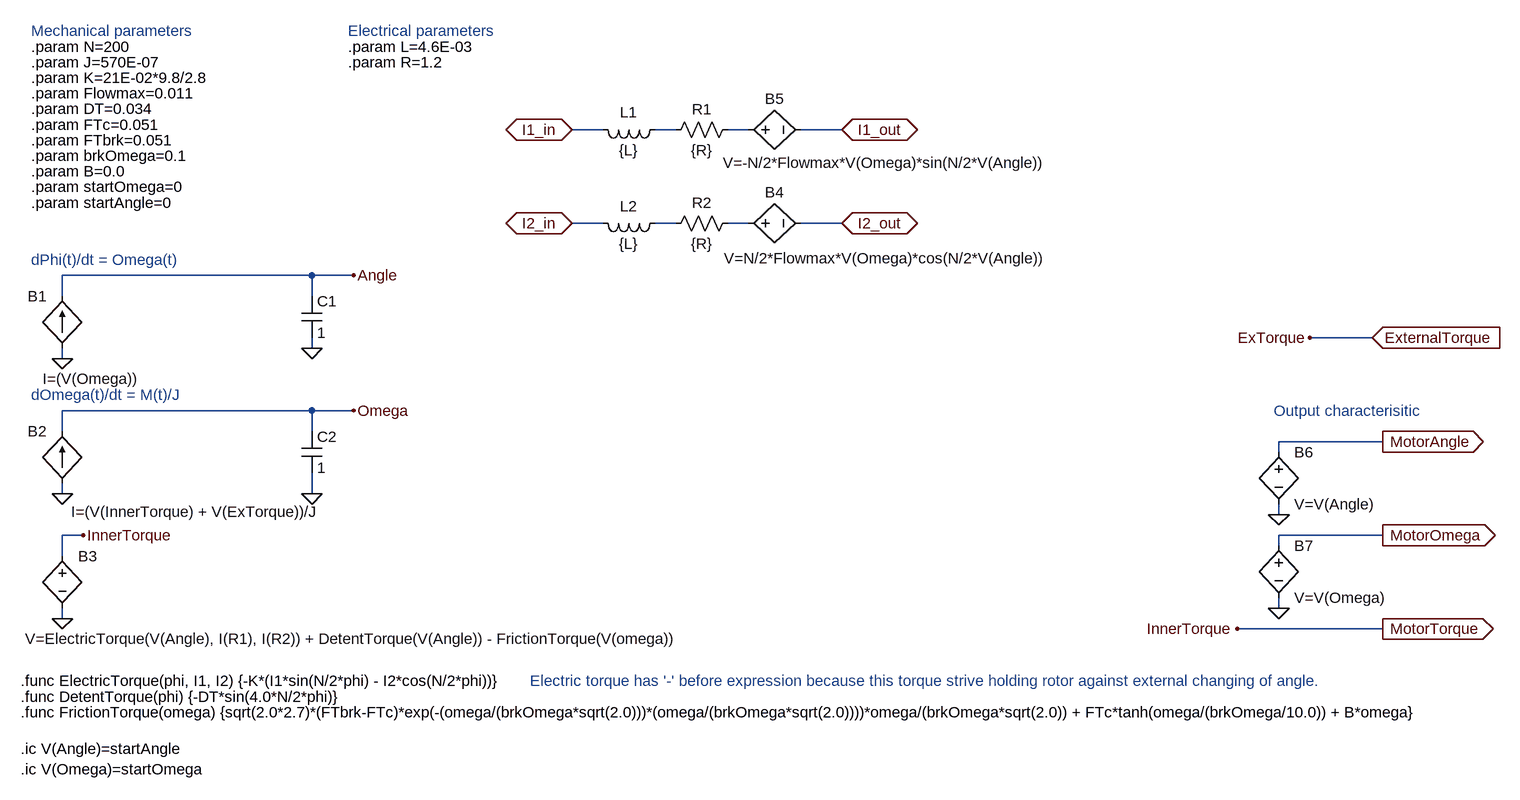
[diagram p0: schematic StepMotor.asc]
StepMotor.asc, the LTspice schematic file:
Version 4
SHEET 1 2772 808
WIRE 1200 -192 1152 -192
WIRE 1312 -192 1280 -192
WIRE 1424 -192 1392 -192
WIRE 1568 -192 1504 -192
WIRE 1200 -48 1152 -48
WIRE 1312 -48 1280 -48
WIRE 1424 -48 1392 -48
WIRE 1568 -48 1504 -48
WIRE 752 32 368 32
WIRE 816 32 752 32
WIRE 368 64 368 32
WIRE 752 64 752 32
WIRE 2384 128 2288 128
WIRE 752 144 752 128
WIRE 368 160 368 144
WIRE 752 240 368 240
WIRE 816 240 752 240
WIRE 368 272 368 240
WIRE 752 272 752 240
WIRE 2400 288 2240 288
WIRE 2240 304 2240 288
WIRE 368 368 368 352
WIRE 752 368 752 336
WIRE 2240 400 2240 384
WIRE 400 432 368 432
WIRE 2400 432 2240 432
WIRE 2240 448 2240 432
WIRE 368 464 368 432
WIRE 2240 544 2240 528
WIRE 368 560 368 544
WIRE 2400 576 2176 576
FLAG 1152 -192 I1_in
IOPIN 1152 -192 BiDir
FLAG 1568 -192 I1_out
IOPIN 1568 -192 BiDir
FLAG 1152 -48 I2_in
IOPIN 1152 -48 BiDir
FLAG 1568 -48 I2_out
IOPIN 1568 -48 BiDir
FLAG 816 32 Angle
FLAG 752 144 0
FLAG 368 160 0
FLAG 752 368 0
FLAG 368 368 0
FLAG 816 240 Omega
FLAG 368 560 0
FLAG 400 432 InnerTorque
FLAG 2240 400 0
FLAG 2240 544 0
FLAG 2400 288 MotorAngle
IOPIN 2400 288 Out
FLAG 2400 432 MotorOmega
IOPIN 2400 432 Out
FLAG 2400 576 MotorTorque
IOPIN 2400 576 Out
FLAG 2384 128 ExternalTorque
IOPIN 2384 128 In
FLAG 2176 576 InnerTorque
FLAG 2288 128 ExTorque
SYMBOL cap 736 64 R0
SYMATTR InstName C1
SYMATTR Value 1
SYMBOL bi 368 144 R180
WINDOW 0 24 80 Left 2
WINDOW 3 -119 -47 Left 2
SYMATTR InstName B1
SYMATTR Value I=(V(Omega))
SYMBOL cap 736 272 R0
SYMATTR InstName C2
SYMATTR Value 1
SYMBOL bi 368 352 R180
WINDOW 0 24 80 Left 2
WINDOW 3 -400 -44 Left 2
SYMATTR InstName B2
SYMATTR Value I=(V(InnerTorque) + V(ExTorque))/J
SYMBOL ind 1296 -208 R90
WINDOW 0 5 56 VBottom 2
WINDOW 3 32 56 VTop 2
SYMATTR InstName L1
SYMATTR Value {L}
SYMBOL res 1296 -176 R270
WINDOW 0 32 56 VTop 2
WINDOW 3 0 56 VBottom 2
SYMATTR InstName R1
SYMATTR Value {R}
SYMBOL ind 1296 -64 R90
WINDOW 0 5 56 VBottom 2
WINDOW 3 32 56 VTop 2
SYMATTR InstName L2
SYMATTR Value {L}
SYMBOL res 1296 -32 R270
WINDOW 0 32 56 VTop 2
WINDOW 3 0 56 VBottom 2
SYMATTR InstName R2
SYMATTR Value {R}
SYMBOL bv 368 448 R0
WINDOW 3 -57 143 Left 2
SYMATTR Value V=ElectricTorque(V(Angle), I(R1), I(R2)) + DetentTorque(V(Angle)) - FrictionTorque(V(omega))
SYMATTR InstName B3
SYMBOL bv 1408 -48 R270
WINDOW 0 32 56 VTop 2
WINDOW 3 -38 227 VBottom 2
SYMATTR InstName B4
SYMATTR Value V=N/2*Flowmax*V(Omega)*cos(N/2*V(Angle))
SYMBOL bv 1408 -192 R270
WINDOW 0 32 56 VTop 2
WINDOW 3 -35 226 VBottom 2
SYMATTR InstName B5
SYMATTR Value V=-N/2*Flowmax*V(Omega)*sin(N/2*V(Angle))
SYMBOL bv 2240 288 R0
SYMATTR InstName B6
SYMATTR Value V=V(Angle)
SYMBOL bv 2240 432 R0
SYMATTR InstName B7
SYMATTR Value V=V(Omega)
TEXT 320 -320 Left 2 !.param N=200
TEXT 320 -296 Left 2 !.param J=570E-07
TEXT 320 -272 Left 2 !.param K=21E-02*9.8/2.8
TEXT 320 -224 Left 2 !.param DT=0.034
TEXT 320 -200 Left 2 !.param FTc=0.051
TEXT 320 -344 Left 2 ;Mechanical parameters
TEXT 808 -344 Left 2 ;Electrical parameters
TEXT 808 -320 Left 2 !.param L=4.6E-03
TEXT 808 -296 Left 2 !.param R=1.2
TEXT 320 8 Left 2 ;dPhi(t)/dt = Omega(t)
TEXT 320 216 Left 2 ;dOmega(t)/dt = M(t)/J
TEXT 304 656 Left 2 !.func ElectricTorque(phi, I1, I2) {-K*(I1*sin(N/2*phi) - I2*cos(N/2*phi))}
TEXT 304 680 Left 2 !.func DetentTorque(phi) {-DT*sin(4.0*N/2*phi)}
TEXT 304 704 Left 2 !.func FrictionTorque(omega) {sqrt(2.0*2.7)*(FTbrk-FTc)*exp(-(omega/(brkOmega*sqrt(2.0)))*(omega/(brkOmega*sqrt(2.0))))*omega/(brkOmega*sqrt(2.0)) + FTc*tanh(omega/(brkOmega/10.0)) + B*omega}
TEXT 320 -176 Left 2 !.param FTbrk=0.051
TEXT 320 -152 Left 2 !.param brkOmega=0.1
TEXT 320 -248 Left 2 !.param Flowmax=0.011
TEXT 2232 240 Left 2 ;Output characterisitic
TEXT 304 760 Left 2 !.ic V(Angle)=startAngle
TEXT 304 792 Left 2 !.ic V(Omega)=startOmega
TEXT 320 -128 Left 2 !.param B=0.0
TEXT 320 -104 Left 2 !.param startOmega=0
TEXT 320 -80 Left 2 !.param startAngle=0
TEXT 1088 656 Left 2 ;Electric torque has '-' before expression because this torque strive holding rotor against external changing of angle.

The netlist it stands for:
* StepMotor.asc
C1 Angle 0 1
B1 0 Angle I=(V(Omega))
C2 Omega 0 1
B2 0 Omega I=(V(InnerTorque) + V(ExTorque))/J
L1 N001 I1_in {L}
R1 N001 N002 {R}
L2 N003 I2_in {L}
R2 N003 N004 {R}
B3 MotorTorque 0 V=ElectricTorque(V(Angle), I(R1), I(R2)) + DetentTorque(V(Angle)) - FrictionTorque(V(omega))
B4 N004 I2_out V=N/2*Flowmax*V(Omega)*cos(N/2*V(Angle))
B5 N002 I1_out V=-N/2*Flowmax*V(Omega)*sin(N/2*V(Angle))
B6 MotorAngle 0 V=V(Angle)
B7 MotorOmega 0 V=V(Omega)
.param N=200
.param J=570E-07
.param K=21E-02*9.8/2.8
.param DT=0.034
.param FTc=0.051
* Mechanical parameters
* Electrical parameters
.param L=4.6E-03
.param R=1.2
* dPhi(t)/dt = Omega(t)
* dOmega(t)/dt = M(t)/J
.func ElectricTorque(phi, I1, I2) {-K*(I1*sin(N/2*phi) - I2*cos(N/2*phi))}
.func DetentTorque(phi) {-DT*sin(4.0*N/2*phi)}
.func FrictionTorque(omega) {sqrt(2.0*2.7)*(FTbrk-FTc)*exp(-(omega/(brkOmega*sqrt(2.0)))*(omega/(brkOmega*sqrt(2.0))))*omega/(brkOmega*sqrt(2.0)) + FTc*tanh(omega/(brkOmega/10.0)) + B*omega}
.param FTbrk=0.051
.param brkOmega=0.1
.param Flowmax=0.011
* Output characterisitic
.ic V(Angle)=startAngle
.ic V(Omega)=startOmega
.param B=0.0
.param startOmega=0
.param startAngle=0
* Electric torque has '-' before expression because this torque strive holding rotor against external changing of angle.
.backanno
.end